# Altium schematic sheet 8bit_reg_v2.SchDoc
size OrCAD D; SheetNumber: 1; SheetTotal: 1
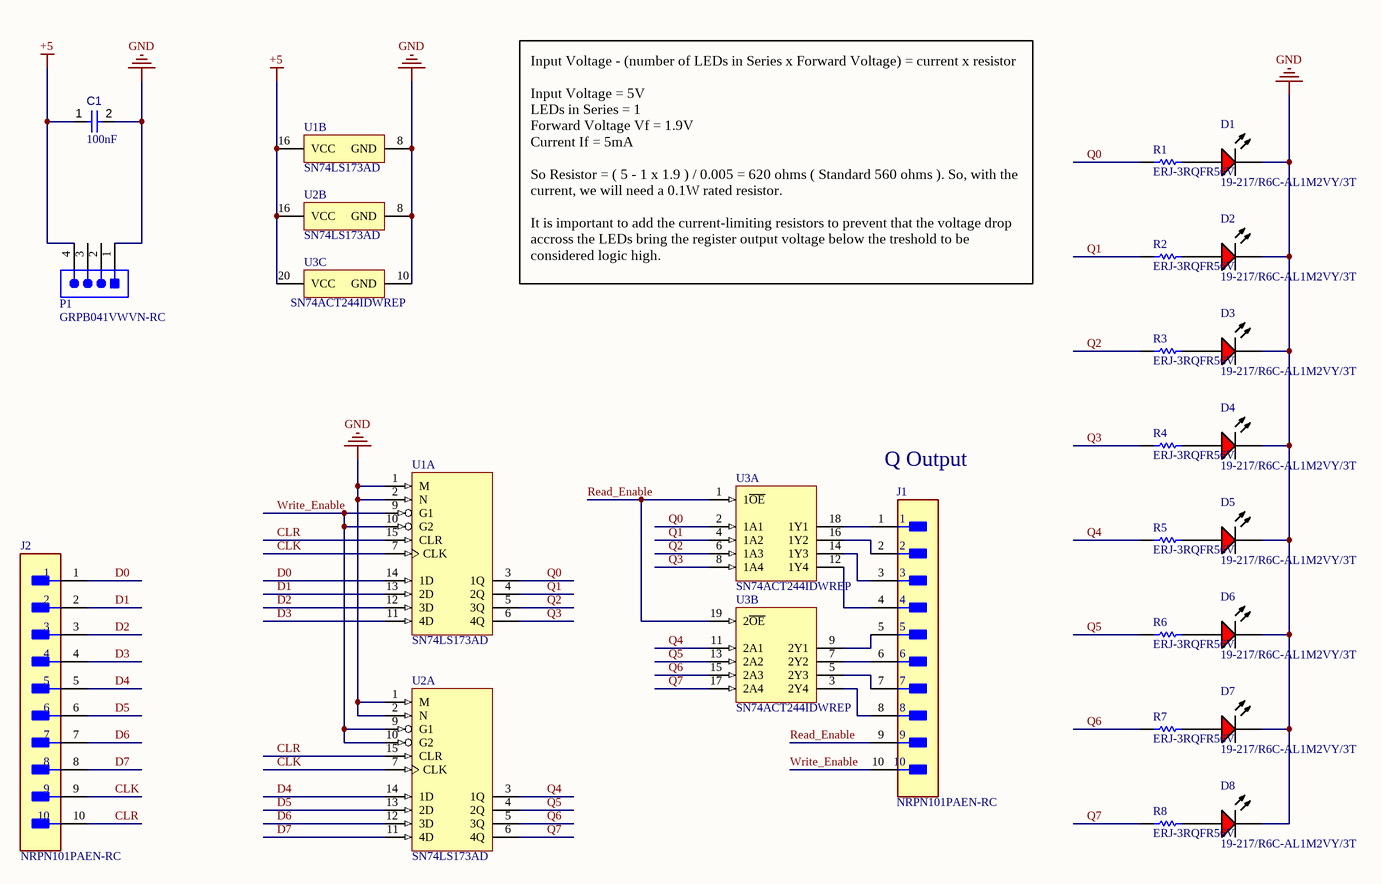
[diagram p0: 8bit_reg_v2.SchDoc]

## Parts
C1  value 100nF  [CAPC1608X90X40NL10T20]  (hidden comment: Capacitor 100 nF +/-10% 50 V 0603)
D1  19-217/R6C-AL1M2VY/3T  [EVRL-0603-2_V]
D2  19-217/R6C-AL1M2VY/3T  [EVRL-0603-2_V]
D3  19-217/R6C-AL1M2VY/3T  [EVRL-0603-2_V]
D4  19-217/R6C-AL1M2VY/3T  [EVRL-0603-2_V]
D5  19-217/R6C-AL1M2VY/3T  [EVRL-0603-2_V]
D6  19-217/R6C-AL1M2VY/3T  [EVRL-0603-2_V]
D7  19-217/R6C-AL1M2VY/3T  [EVRL-0603-2_V]
D8  19-217/R6C-AL1M2VY/3T  [EVRL-0603-2_V]
J1  NRPN101PAEN-RC  [FP-NRPN101PAEN-RC-MFG]
J2  NRPN101PAEN-RC  [FP-NRPN101PAEN-RC-MFG]
P1  GRPB041VWVN-RC  [SLIN-GRPB041VWVN-RC_V]
R1  ERJ-3RQFR56V  [RESC1608X55X30NL15T15]
R2  ERJ-3RQFR56V  [RESC1608X55X30NL15T15]
R3  ERJ-3RQFR56V  [RESC1608X55X30NL15T15]
R4  ERJ-3RQFR56V  [RESC1608X55X30NL15T15]
R5  ERJ-3RQFR56V  [RESC1608X55X30NL15T15]
R6  ERJ-3RQFR56V  [RESC1608X55X30NL15T15]
R7  ERJ-3RQFR56V  [RESC1608X55X30NL15T15]
R8  ERJ-3RQFR56V  [RESC1608X55X30NL15T15]
U1  SN74LS173AD  [D0016A_M]  (parts A,B of 2)
U2  SN74LS173AD  [D0016A_M]  (parts A,B of 2)
U3  SN74ACT244IDWREP  [DW0020A_L]  (parts A,B,C of 3)

## Nets
+5: C1.1 P1.4 U1.16(VCC) U2.16(VCC) U3.20(VCC)
GND: C1.2 D1.2(K) D2.2(K) D3.2(K) D4.2(K) D5.2(K) D6.2(K) D7.2(K) D8.2(K) P1.1 U1.1(M) U1.2(N) U1.8(GND) U2.1(M) U2.2(N) U2.8(GND) U3.10(GND)
CLK: J2.9 U1.7(CLK) U2.7(CLK)
CLR: J2.10 U1.15(CLR) U2.15(CLR)
D0: J2.1 U1.14(1D)
D1: J2.2 U1.13(2D)
D2: J2.3 U1.12(3D)
D3: J2.4 U1.11(4D)
D4: J2.5 U2.14(1D)
D5: J2.6 U2.13(2D)
D6: J2.7 U2.12(3D)
D7: J2.8 U2.11(4D)
Q0: R1.1 U1.3(1Q) U3.2(1A1)
Q1: R2.1 U1.4(2Q) U3.4(1A2)
Q2: R3.1 U1.5(3Q) U3.6(1A3)
Q3: R4.1 U1.6(4Q) U3.8(1A4)
Q4: R5.1 U2.3(1Q) U3.11(2A1)
Q5: R6.1 U2.4(2Q) U3.13(2A2)
Q6: R7.1 U2.5(3Q) U3.15(2A3)
Q7: R8.1 U2.6(4Q) U3.17(2A4)
Read_Enable: J1.9 U3.1(1~{OE}) U3.19(2~{OE})
Write_Enable: J1.10 U1.9(G1) U1.10(G2) U2.9(G1) U2.10(G2)
NetD1_1: D1.1(A) R1.2
NetD2_1: D2.1(A) R2.2
NetD3_1: D3.1(A) R3.2
NetD4_1: D4.1(A) R4.2
NetD5_1: D5.1(A) R5.2
NetD6_1: D6.1(A) R6.2
NetD7_1: D7.1(A) R7.2
NetD8_1: D8.1(A) R8.2
NetJ1_1: J1.1 U3.18(1Y1)
NetJ1_2: J1.2 U3.16(1Y2)
NetJ1_3: J1.3 U3.14(1Y3)
NetJ1_4: J1.4 U3.12(1Y4)
NetJ1_5: J1.5 U3.9(2Y1)
NetJ1_6: J1.6 U3.7(2Y2)
NetJ1_7: J1.7 U3.5(2Y3)
NetJ1_8: J1.8 U3.3(2Y4)

Not connected (* = marked no-connect by the designer): P1 2 3

## Notes on the sheet
- Input Voltage - (number of LEDs in Series x Forward Voltage) = current x resistor
  Input Voltage = 5V
  LEDs in Series = 1
  Forward Voltage Vf = 1.9V
  Current If = 5mA
  So Resistor = ( 5 - 1 x 1.9 ) / 0.005 = 620 ohms ( Standard 560 ohms ). So, with the current, we will need a 0.1W rated resistor.
  It is important to add the current-limiting resistors to prevent that the voltage drop accross the LEDs bring the register output voltage below the treshold to be considered logic high.
- Q Output

## Library data of the parts
C1 = CMP-001-00017-6: Chip Capacitor, 100 nF, +/- 10%, 50 V, 0603 (1608 Metric); Voltage Rating: 50V; Capacitor Type: Ceramic; Tolerance: 10%; Mounting Technology: SM; Max Operating Temperature: 125°C; RoHS Compliant: True; Pins: 2; Case/Package: 0603; Min Operating Temperature: -55°C
D1-D8 = CMP-007-00004-2: Chip LED, Red, 5 V, 25 mA, -40 to 85 degC, 2-Pin SMD (0603), RoHS, Tape and Reel; Manufacturer: Everlight Electronics; Forward Voltage: 2.2V; Lens Style: Clear; Package Reference: 0603; Datasheet Version: Rev. 1, 01/2005; Mounting Technology: SM; RoHS Compliant: False; Datasheet URL: https://datasheet.ciiva.com/4688/el-19-217-r6c-al1m2vy-3tpdf-187026-4688713.pdf; Case/Package: 0603; Colour: Red; Manufacturer URL: http://www.everlight.com/; Package Description: 2-Pin Surface Mount Device, Body 1.6 x 0.8 mm
J1 J2 = CMP-25680-000006-1: CONN HEADER VERT 10POS 2MM; Manufacturer: Sullins; Current Rating: 2A; Conn Gender: Male; Voltage Rating: 150V; Conn Orientation: Straight; Number Of Contacts: 10; Temperature: -40°C to +105°C; Manufacturer Part Number: NRPN101PAEN-RC; Package: 0; Lead Free: Yes; Device Class L3: unset; Octopart: https://octopart.com/nrpn101paen-rc-sullins-18674398; Device Class L1: Connectors; Contact Material: Gold,Nickel; ComponentLink2URL: https://s3.amazonaws.com/catalogspreads-pdf/PAGE104-105%202mm%20MALE%20HDR%20ST%20RA%20SMT.pdf; Footprint Url: https://drawings-pdf.s3.amazonaws.com/10531.pdf; Height: 5.95mm; Digikey Description: CONN HEADER VERT 10POS 2MM; Category: Conn; Automotive: No; Number Of Rows: 1; Device Class L2: Headers and Wire Housings; Temperature Range High: +105°C; Temperature Range Low: -40°C; Pitch: 2mm; RoHS: TRUE; ComponentLink2Description: Datasheet
P1 = CMP-2000-06373-1: Male Header, Pitch 1.27 mm, 1 x 4 Position, Height 4 mm, Tail Length 2.3 mm, -40 to 105 degC, RoHS, Bulk; Manufacturer: Sullins; Mating Products: S9010E-04-ND / -CONNHEADER.050"4POSR/APCB / S9008E-04-ND / -CONNHEADER.050"4POSPCBGOLD / S9005E-04-ND / -CONNHEADER.050"4POSSMDGOLD; Other Names: S9014E-04; Dynamic Catalog: GRPB; Pitch: 0.050"(1.27mm); Number of Positions Loaded: All; Number of Positions: 4; Catalog Drawings: S9014ESeriesTop; Connector Type: Header,Unshrouded; Contact Finish Thickness: Flash; Number of Rows: 1; Contact Type: MalePin; Category: Connectors,Interconnects; Contact Mating Length: 0.118"(3.00mm); Family: RectangularConnectors-Headers,MalePins; Datasheet Version: Rev. C, 12/2008; Contact Finish: Gold; Termination: Solder; Manufacturer URL: http://www.sullinscorp.com/; Mounting Type: ThroughHole; Packaging: Bulk; Package Reference: GRPB041VWVN-RC; Datasheet URL: http://www.sullinscorp.com/drawings/71_GRPB___1VWVN-RC,_10957-C.pdf; Mounting Technology: ThroughHole; Package Description: Male Header, Pitch 1.27 mm, 1 x 4 Position, Height 4 mm, Tail Length 2.3 mm; Standard Package: 1
R1-R8 = CMP-2000-00858-1: Manufacturer: Panasonic; Part Number: ERJ-3RQFR56V
U1 U2 = CMP-019-00049-1: TEXAS INSTRUMENTS SN74LS173AD Flip-Flop, D, 17 ns, 50 MHz, 24 mA, SOIC, 16 Pins
U3 = CMP-0440-00699-3: Enhanced Product Octal Buffers/Drivers With 3-State Outputs, DW0020A, LARGE T&R; Generic Part Number: SN74ACT244-EP; Manufacturer: Texas Instruments; Rating: HiRel Enhanced Product; VCC(Max)(V): 5.5; Output Type: CMOS; ICC @ Nom Voltage(Max)(mA): 0.04; F @ Nom Voltage(Max)(Mhz): 90; tpd @ Nom Voltage(Max)(ns): 9; Voltage(Nom)(V): 5; Input Type: TTL; VCC(Min)(V): 4.5; PackageReference: DW0020A; Code_JEDEC: MS-013; DatasheetVersion: SCAS724B; Operating Temperature Range(C): -40 to 85; PackageVersion: http://www.ti.com/lit/ml/mpds173a/mpds173a.pdf